# EAGLE design cc1101-sniffer (EAGLE 9.6.2)
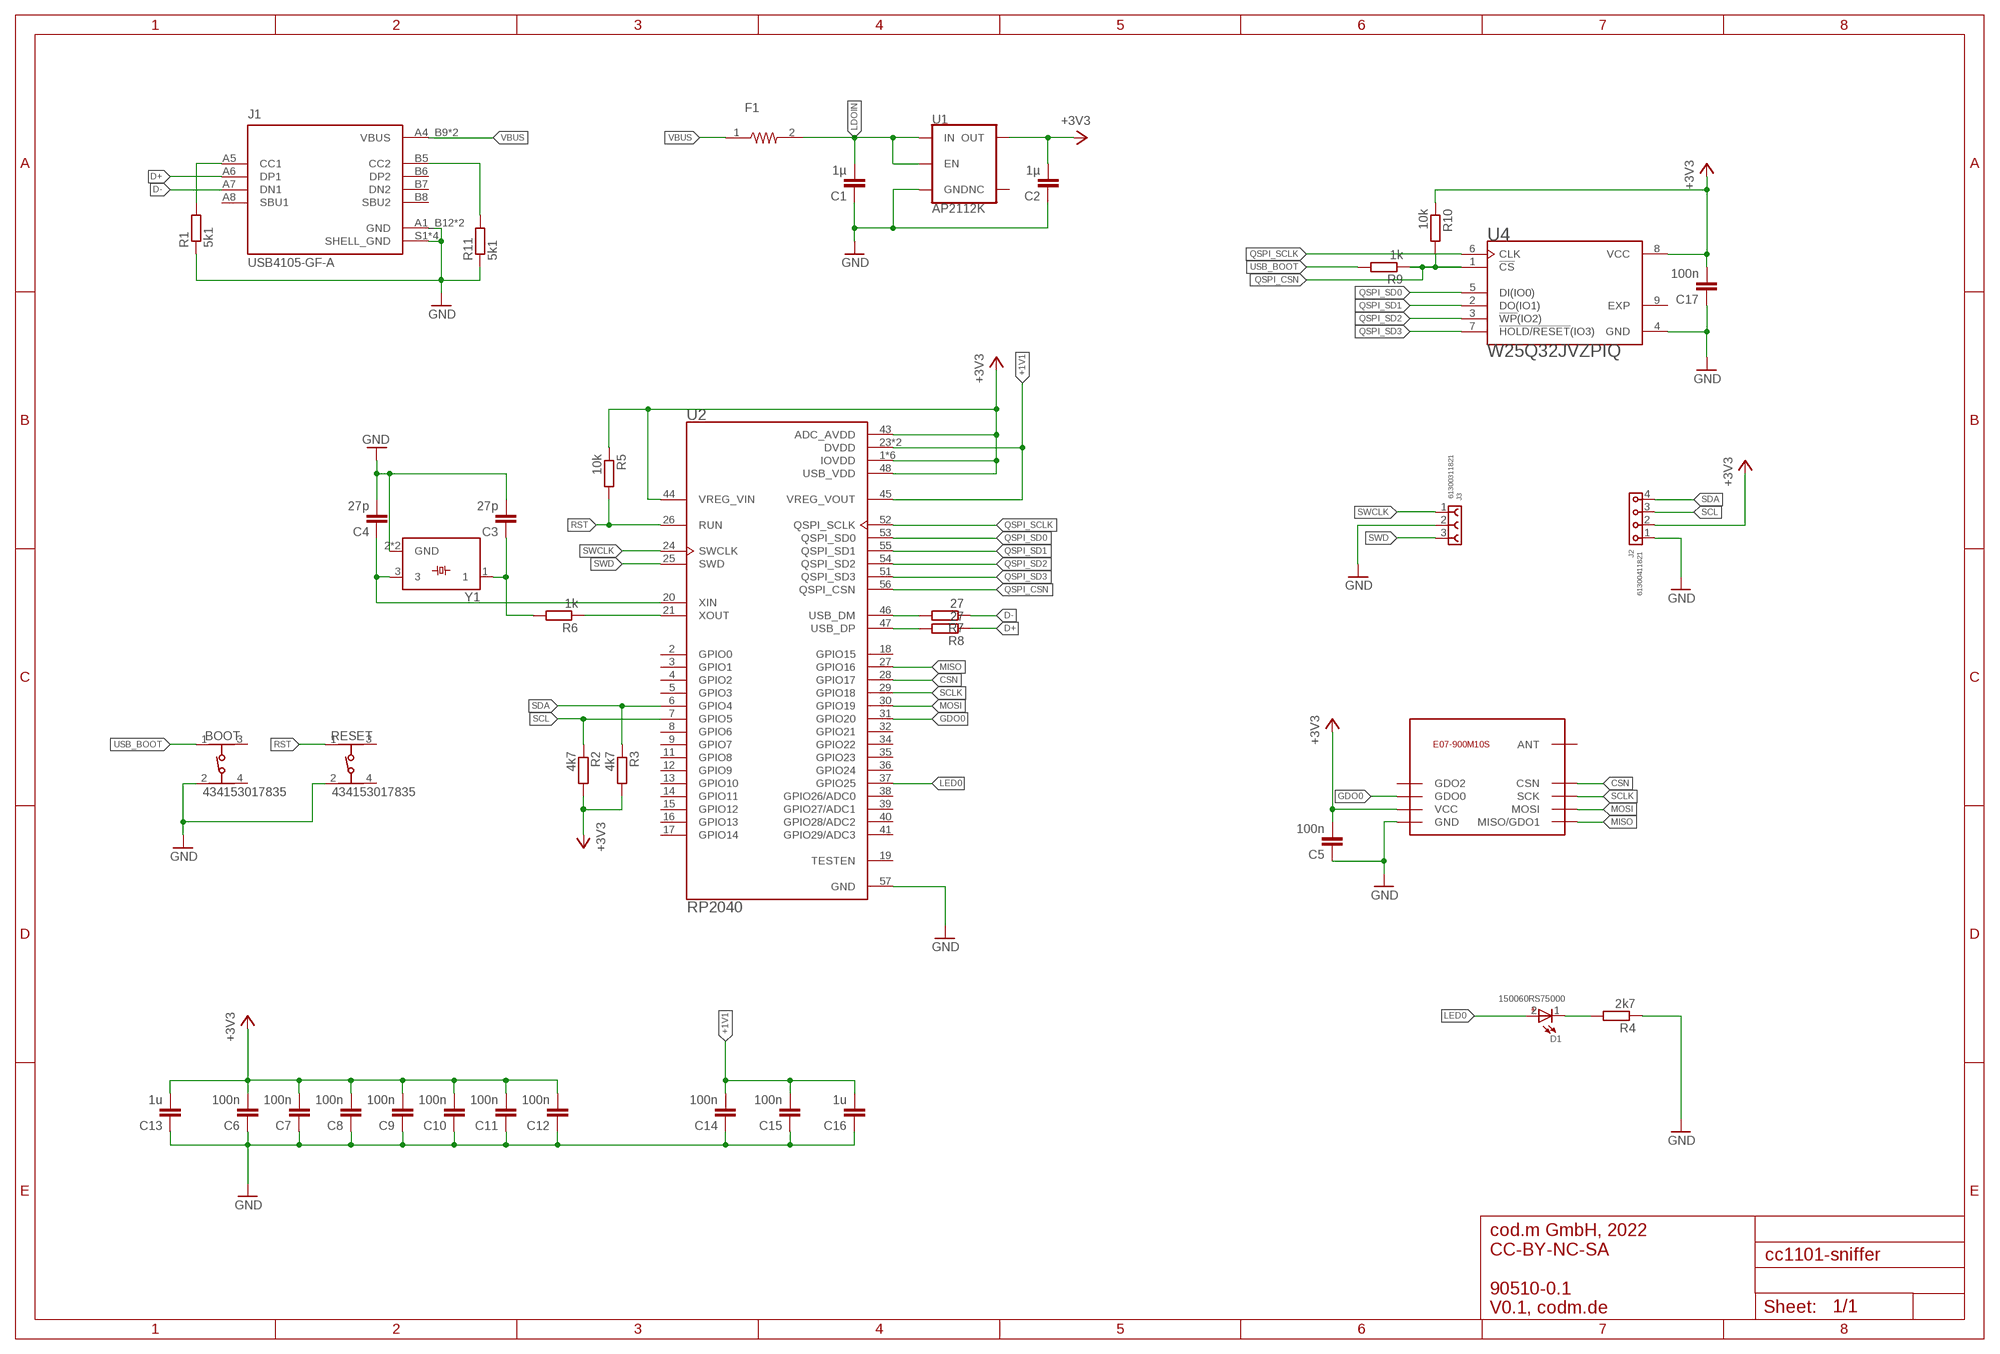
[diagram p0: schematic, sheet 1]

## Parts
BOOT  434153017835  [434153017835]
C1  1µ  C-EUC0805K  [C0805K]
C2  1µ  C-EUC0805K  [C0805K]
C3  27p  C-EUC0603K  [C0603K]
C4  27p  C-EUC0603K  [C0603K]
C5  100n  C-EUC0603K  [C0603K]
C6  100n  C-EUC0603K  [C0603K]
C7  100n  C-EUC0603K  [C0603K]
C8  100n  C-EUC0603K  [C0603K]
C9  100n  C-EUC0603K  [C0603K]
C10  100n  C-EUC0603K  [C0603K]
C11  100n  C-EUC0603K  [C0603K]
C12  100n  C-EUC0603K  [C0603K]
C13  1u  C-EUC0603K  [C0603K]
C14  100n  C-EUC0603K  [C0603K]
C15  100n  C-EUC0603K  [C0603K]
C16  1u  C-EUC0603K  [C0603K]
C17  100n  C-EUC0603K  [C0603K]
D1  150060RS75000  WL-SMCW_0603_150060RS75000  [WL-SMCW_0603]
F1  PICOSMDC050S-2  [RESC2012X65N]
J1  USB4105-GF-A  [GCT_USB4105-GF-A]
J2  61300411821  6130XX11821_61300411821  [61300411821]
J3  61300311821  6130XX11821_61300311821  [61300311821]
R1  5k1  R-EU_R0603RF  [R0603RF]
R2  4k7  R-EU_R0603RF  [R0603RF]
R3  4k7  R-EU_R0603RF  [R0603RF]
R4  2k7  R-EU_R0603RF  [R0603RF]
R5  10k  R-EU_R0603RF  [R0603RF]
R6  1k  R-EU_R0603RF  [R0603RF]
R7  27  R-EU_R0603RF  [R0603RF]
R8  27  R-EU_R0603RF  [R0603RF]
R9  1k  R-EU_R0603RF  [R0603RF]
R10  10k  R-EU_R0603RF  [R0603RF]
R11  5k1  R-EU_R0603RF  [R0603RF]
RESET  434153017835  [434153017835]
U1  AP2112K  V_REG_AP2112K-3.3V  [SOT23-5]
U2  RP2040  [QFN40P700X700X90-57N]
U4  W25Q32JVZPIQ  [SON127P600X500X80-9N]
U$6  E07-900M10S  [E07-900M10S]
Y1  ABM8G-12.000MHZ-18-D2Y-T3  [OSCSC320X250X100N]

## Nets
+1V1: C14.2 C15.2 C16.2 U2.23(DVDD) U2.45(VREG_VOUT) U2.50(DVDD)
+3V3: C2.2 C5.2 C6.2 C7.2 C8.2 C9.2 C10.2 C11.2 C12.2 C13.2 C17.2 J2.2 R2.2 R3.2 R5.1 R10.1 U1.5(OUT) U2.1(IOVDD) U2.10(IOVDD) U2.22(IOVDD) U2.33(IOVDD) U2.42(IOVDD) U2.43(ADC_AVDD) U2.44(VREG_VIN) U2.48(USB_VDD) U2.49(IOVDD) U4.8(VCC) U$6.9(VCC)
CSN: U2.28(GPIO17) U$6.19(CSN)
D+: J1.A6(DP1) R8.1
D-: J1.A7(DN1) R7.1
GDO0: U2.31(GPIO20) U$6.15(GDO0)
GND: BOOT.2 C1.1 C2.1 C3.2 C4.2 C5.1 C6.1 C7.1 C8.1 C9.1 C10.1 C11.1 C12.1 C13.1 C14.1 C15.1 C16.1 C17.1 J1.A1_B12(GND) J1.B1_A12(GND) J1.S1(SHELL_GND) J1.S2(SHELL_GND) J1.S3(SHELL_GND) J1.S4(SHELL_GND) J2.1 J3.2 R1.1 R4.1 R11.1 RESET.2 U1.2(GND) U2.57(GND) U4.4(GND) U$6.1(GND) U$6.2(GND) U$6.3(GND) U$6.4(GND) U$6.5(GND) U$6.11(GND) U$6.12(GND) U$6.20(GND) U$6.22(GND) Y1.2(GND) Y1.4(GND)
LDOIN: C1.2 F1.2 U1.1(IN) U1.3(EN)
LED0: D1.2(+) U2.37(GPIO25)
MISO: U2.27(GPIO16) U$6.16(MISO/GDO1)
MOSI: U2.30(GPIO19) U$6.17(MOSI)
N$1: C4.1 U2.20(XIN) Y1.3
N$2: R6.1 U2.21(XOUT)
N$3: C3.1 R6.2 Y1.1
N$4: R8.2 U2.47(USB_DP)
N$6: J1.A5(CC1) R1.2
N$7: D1.1(-) R4.2
N$8: R7.2 U2.46(USB_DM)
N$9: J1.B5(CC2) R11.2
QSPI_CSN: R9.1 R10.2 U2.56(QSPI_CSN) U4.1(!CS)
QSPI_SCLK: U2.52(QSPI_SCLK) U4.6(CLK)
QSPI_SD0: U2.53(QSPI_SD0) U4.5(DI(IO0))
QSPI_SD1: U2.55(QSPI_SD1) U4.2(DO(IO1))
QSPI_SD2: U2.54(QSPI_SD2) U4.3(!WP!(IO2))
QSPI_SD3: U2.51(QSPI_SD3) U4.7(!HOLD/RESET!(IO3))
RST: R5.2 RESET.1 U2.26(RUN)
SCL: J2.3 R2.1 U2.7(GPIO5)
SCLK: U2.29(GPIO18) U$6.18(SCK)
SDA: J2.4 R3.1 U2.6(GPIO4)
SWCLK: J3.1 U2.24(SWCLK)
SWD: J3.3 U2.25(SWD)
USB_BOOT: BOOT.1 R9.2
VBUS: F1.1 J1.A4_B9(VBUS) J1.B4_A9(VBUS)
Unconnected: BOOT.3 BOOT.4 J1.A8(SBU1) J1.B6(DP2) J1.B7(DN2) J1.B8(SBU2) RESET.3 RESET.4 U1.4(NC) U2.2(GPIO0) U2.3(GPIO1) U2.4(GPIO2) U2.5(GPIO3) U2.8(GPIO6) U2.9(GPIO7) U2.11(GPIO8) U2.12(GPIO9) U2.13(GPIO10) U2.14(GPIO11) U2.15(GPIO12) U2.16(GPIO13) U2.17(GPIO14) U2.18(GPIO15) U2.19(TESTEN) U2.32(GPIO21) U2.34(GPIO22) U2.35(GPIO23) U2.36(GPIO24) U2.38(GPIO26/ADC0) U2.39(GPIO27/ADC1) U2.40(GPIO28/ADC2) U2.41(GPIO29/ADC3) U4.9(EXP) U$6.14(GDO2) U$6.21(ANT)

## Notes on the sheet
- cod.m GmbH, 2022
  CC-BY-NC-SA
  
  90510-0.1
  V0.1, codm.de

## Library data of the parts
BOOT RESET = Eagle_WS-TASV (rev22a):434153017835: WS-TASV J-Bend SMT Tact Switch 3.5x2.9 mm Material Properties Cover Material : Stainless Steel Properties Actuator Material:LCP Actuator Flammability Rating:UL94 V-0 Actuator Color:Blue Frame Material:PA46 Frame Flammability Rating:UL94 HB Frame Color:Black Contact Material:Stainless Steel Contact Plating:Silver Terminal Material:Copper Alloy Terminal Plating:Silver VR:12 V (DC) Contact Resistance Initial:100 mΩ Contact Resistance After Life Test:1 Ω RISO:100 MΩ Withstanding Voltage:250 V (AC) Washable:No Qty.:4000 Mechanical Properties Stroke :0.15 mm General Information Operating Temperature:-40 up to +85 °C Washable:No Packaging Properties Packaging:Tape and Reel <https://www.we-online.com/catalog/media/o72753v209%20WS-TASU_434331013822_a_4C.jpg> Details see: https://www.we-online.com/catalog/en/TASV_3_5X2_9_SMD_J-BEND/ Updated by yingchun,Shan;2020-02-18 2020(C) Würth Elektronik; DATASHEET-URL: https://www.we-online.com/catalog/datasheet/434153017835.pdf; H: 1.7mm; OPERATION-FORCE: 350g; PART-NUMBER: 434153017835; QTY: 4000
C1-C17 = rcl:C-EU: CAPACITOR, European symbol; SPICEPREFIX: C
D1 = Eagle_WL-SMCW (rev22a):WL-SMCW_0603: WL-SMCW SMT Mono-color Chip LED Waterclea Characteristics Low energy consumption High reliability Low current requirement Fast switching No UV/IR radiation Smallest SMD LED package for exceptional brightness Top view LED Wide viewing angle Better solder ability Heat dissipation Applications Backlight for mobile and portable device keypads Indoor and outdoor message boards Flat backlight for LCDs, switches and symbols Display for industrial control systems and traffic Miniaturized color effects Pedestrian mark Optical indicators Tabular backlight: LCD, telephone key-press, power-switch, display board Indoor displays Signals Identifiers Backlight for automobile DVD LED General lighting Toys <https://www.we-online.com/catalog/media/o14904v209%20Family_WL-SMCW.jpg> Details see: https://www.we-online.com/catalog/en/WL-SMCW/ Updated BY Yingchun,Shan 2020-03-18 2020(C) Wurth Elektronik; CHIP-TECHNOLOGY: AlInGaP; DATASHEET-URL: https://www.we-online.com/catalog/datasheet/150060RS75000.pdf; DOMINANT-WAVELENGTH: 625nm; EMITTING-COLOR: Red; FORWARD-VOLTAGE: 140°; LUMINOUS-INTENSITY: 250mcd; PART-NUMBER: 150060RS75000; PEAK-WAVELENGTH: 630nm
F1 = PICOSMDC050S-2:PICOSMDC050S-2: FUSE, RESETTABLE PTC, 6VDC, 0.5A, SMD Check availability <https://pricing.snapeda.com/parts/PICOSMDC050S-2/Littelfuse%20Inc./view-part?ref=eda>; AVAILABILITY: In Stock; DESCRIPTION: Polymeric PTC Resettable Fuse 6V 500 mA Ih Surface Mount 0805 (2012 Metric), Concave; MF: Littelfuse Inc.; MP: PICOSMDC050S-2; PACKAGE: 0805 TE Connectivity; PRICE: None; PURCHASE-URL: https://pricing.snapeda.com/search/part/PICOSMDC050S-2/?ref=eda
J1 = USB4105-GF-A:USB4105-GF-A: USB-C (USB TYPE-C) USB 2.0 Receptacle Connector 24 (16+8 Dummy) Position Surface Mount, Right Angle; Through Hole Check availability <https://pricing.snapeda.com/parts/USB4105-GF-A/GCT/view-part?ref=eda>; AVAILABILITY: In Stock; DESCRIPTION: USB-C (USB TYPE-C) USB 2.0 Receptacle Connector 24 (16+8 Dummy) Position Surface Mount, Right Angle; Through Hole; MF: GCT; MP: USB4105-GF-A; PACKAGE: None; PRICE: None; PURCHASE-URL: https://pricing.snapeda.com/search/part/USB4105-GF-A/?ref=eda
J2 = Eagle_WR-PHD (rev21a):6130XX11821_61300411821: WR-PHD 2.54 mm Socket Header ARTICLE PROPERTIES: Pins:1;​ 2;​ 3;​ 4;​ 5;​ 6;​ 7;​ 8;​ 9;​ 10;​ 12;​ 13;​ 14;​ 15;​ 16;​ 18;​ 20;​ 22;​ 24;​ 25;​ 32;​ 36;​ 40 KIND PROPERTIES: Pitch：2.54 mm Quality Class:3 as per CECC 75 301-802 Rows：Single Gender：Socket Header;​ Female Type：Straight MATERIAL PROPERTIES: Insulator Material :PBT Insulator Flammability Rating:UL94 V-0 Contact Material:Copper Alloy Contact Plating:Gold Contact Type:Stamped GENERAL INFORMATION Operating Temperature:-40 up to +125 °C Compliance:Lead free / RoHS ELECTRICAL PROPERTIES: Rated Current:3 A IR 1:3 A Withstanding Voltage:500 V (AC) Contact Resistance:20 mΩ RISO:1000 MΩ CERTIFICATION UL Approval:E323964 PACKAGING PROPERTIES Packaging:Tray <https://katalog.we-online.com/media/images/v2/o33218v209%20Family_WR-PHD_613xxx11821.jpg> Details see: https://katalog.we-online.com/en/em/PHD_2_54_SOCKET_HEADER_6130XX11821 Updated by Yingchun,Shan 2019-10-21 2019 (C) Würth Elektronik; DATASHEET-URL: https://www.we-online.com/catalog/datasheet/61300411821.pdf; GENDER: Socket Header; IR: 3A; MOUNT: THT; PACKAGING: Tray; PART-NUMBER: 61300411821; PINS: 4; PITCH: 2.54mm; ROWS: Single; TYPE: Straight
J3 = Eagle_WR-PHD (rev21a):6130XX11821_61300311821: WR-PHD 2.54 mm Socket Header ARTICLE PROPERTIES: Pins:1;​ 2;​ 3;​ 4;​ 5;​ 6;​ 7;​ 8;​ 9;​ 10;​ 12;​ 13;​ 14;​ 15;​ 16;​ 18;​ 20;​ 22;​ 24;​ 25;​ 32;​ 36;​ 40 KIND PROPERTIES: Pitch：2.54 mm Quality Class:3 as per CECC 75 301-802 Rows：Single Gender：Socket Header;​ Female Type：Straight MATERIAL PROPERTIES: Insulator Material :PBT Insulator Flammability Rating:UL94 V-0 Contact Material:Copper Alloy Contact Plating:Gold Contact Type:Stamped GENERAL INFORMATION Operating Temperature:-40 up to +125 °C Compliance:Lead free / RoHS ELECTRICAL PROPERTIES: Rated Current:3 A IR 1:3 A Withstanding Voltage:500 V (AC) Contact Resistance:20 mΩ RISO:1000 MΩ CERTIFICATION UL Approval:E323964 PACKAGING PROPERTIES Packaging:Tray <https://katalog.we-online.com/media/images/v2/o33218v209%20Family_WR-PHD_613xxx11821.jpg> Details see: https://katalog.we-online.com/en/em/PHD_2_54_SOCKET_HEADER_6130XX11821 Updated by Yingchun,Shan 2019-10-21 2019 (C) Würth Elektronik; DATASHEET-URL: https://www.we-online.com/catalog/datasheet/61300311821.pdf; GENDER: Socket Header; IR: 3A; MOUNT: THT; PACKAGING: Tray; PART-NUMBER: 61300311821; PINS: 3; PITCH: 2.54mm; ROWS: Single; TYPE: Straight
R1-R11 = codm:R-EU_
U1 = SparkFun-IC-Power:V_REG_AP2112: AP2112 - 600mA CMOS LDO Regulator w/ Enable The AP2112 is CMOS process low dropout linear regulator with enable function, the regulator delivers a guaranteed 600mA (min.) continuous load current. Features Output Voltage Accuracy: ±1.5% Output Current: 600mA (Min.) Foldback Short Current Protection: 50mA Enable Function to Turn ON/OFF VOUT Low Dropout Voltage (3.3V): 250mV (Typ.) @IOUT=600mA Excellent Load Regulation: 0.2%/A (Typ.) Excellent Line Regulation: 0.02%/V (Typ.) Low Quiescent Current: 55μA (Typ.) Low Standby Current: 0.01μA (Typ.) Low Output Noise: 50μVRMS PSRR: 100Hz -65dB, 1kHz -65dB OTSD Protection Stable with 1.0μF Flexible Cap: Ceramic, Tantalum and Aluminum Electrolytic Operation Temperature Range: -40°C to 85°C ESD: MM 400V, HBM 4000V; PROD_ID: VREG-12457; VALUE: 3.3V
U2 = RP2040:RP2040: Check availability <https://pricing.snapeda.com/parts/RP2040/Raspberry%20Pi/view-part?ref=eda>; AVAILABILITY: In Stock; DESCRIPTION: RP2040 chip for Raspberry Pi Pico - ARM® Cortex®-M0+ MCU 32-Bit; MF: Raspberry Pi; MP: RP2040; PACKAGE: Package; PRICE: None; PURCHASE-URL: https://pricing.snapeda.com/search/part/RP2040/?ref=eda
U4 = W25Q32JVZPIQ:W25Q32JVZPIQ: Serial Flash Memory With Dual, Quad Spi Check availability <https://pricing.snapeda.com/parts/W25Q32JVZPIQ/Winbond/view-part?ref=eda>; AVAILABILITY: In Stock; DESCRIPTION: FLASH - NOR Memory IC 32Mb (4M x 8) SPI - Quad I/O 133 MHz 8-WSON (6x5); MF: Winbond; MP: W25Q32JVZPIQ; PACKAGE: WSON-8 Winbond; PRICE: None; PURCHASE-URL: https://pricing.snapeda.com/search/part/W25Q32JVZPIQ/?ref=eda
U$6 = codm:E07-900M10S
Y1 = ABM8G-12.000MHZ-18-D2Y-T3:ABM8G-12.000MHZ-18-D2Y-T3: Crystal 20MHz Â±20ppm (Tol) Â±30ppm (Stability) 18pF FUND 80Ohm 4-Pin Mini-CSMD T/R Check availability <https://pricing.snapeda.com/parts/ABM8G-12.000MHZ-18-D2Y-T3/Abracon/view-part?ref=eda>; AVAILABILITY: In Stock; DESCRIPTION: 12 MHz ±20ppm Crystal 18pF 120 Ohms 4-SMD, No Lead; MF: Abracon; MP: ABM8G-12.000MHZ-18-D2Y-T3; PACKAGE: SMD-4 Abracon; PRICE: None; PURCHASE-URL: https://pricing.snapeda.com/search/part/ABM8G-12.000MHZ-18-D2Y-T3/?ref=eda

## Board
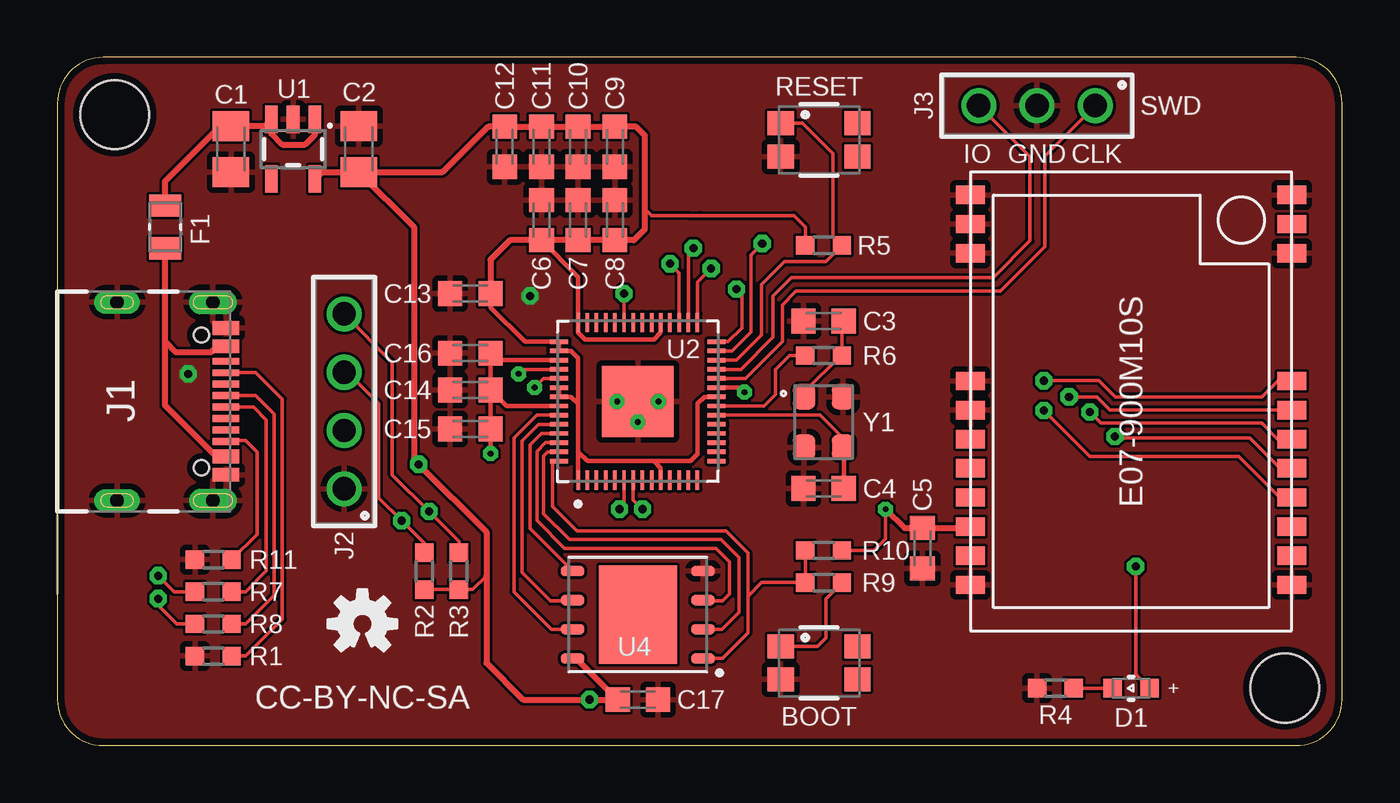
[diagram p1: board, top side]
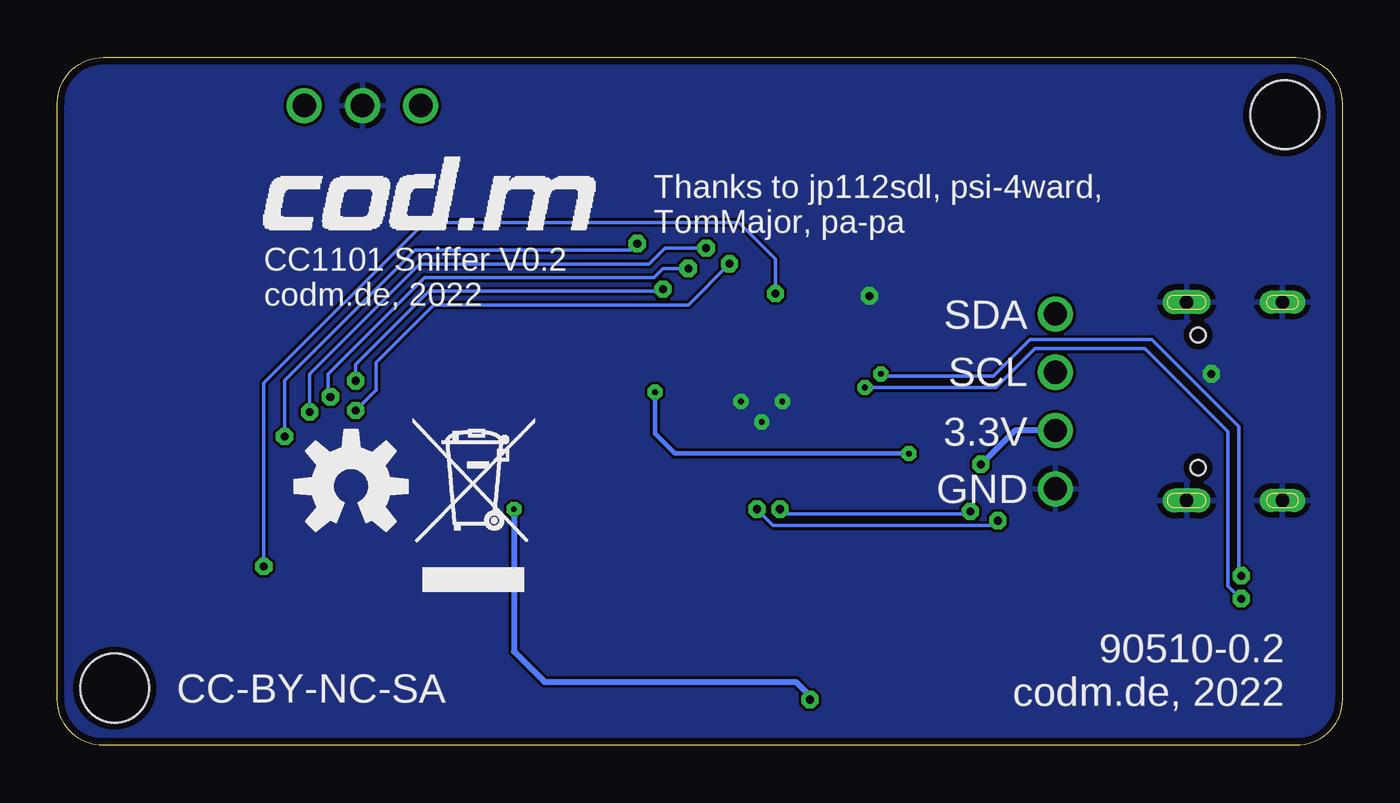
[diagram p2: board, bottom side, seen from below]

Size 56 x 30 mm. Coordinates in mm from the lower left corner, seen from the top.
Outline: 0,2 arc90 2,0 54,0 arc90 56,2 56,28 arc90 54,30 2,30 arc90 0,28 0,2
Copper layers (1*16): Top 0.035mm / dielectric 1.5mm / Bottom 0.035mm
Design rules "aisler_2_layer_complex": minimum track width 0.125mm, minimum drill 0.2mm, track to track 0.125mm, track to pad 0.125mm, pad to pad 0.125mm, via to via 0.125mm, smd to smd 0.125mm, copper to edge 0.3mm, drill to drill 0.25mm, minimum pad ring 0.2mm, minimum via ring 0.2mm, stop-mask expansion 0mil, vias tented up to drill 0mil, thermal gap 10mil
Holes 3 mm at 53.5,2.5 2.5,27.5

### Footprints (pad centres in the part's own frame; a part is rotated, then mirrored left to right if it is on the bottom)
434153017835 = smd 1.15 x 1.05: 1 -1.675,0.725; 2 -1.675,-0.725; 3 1.675,0.725; 4 1.675,-0.725
C0805K = smd 1.3 x 1.6: 1 -1,0; 2 1,0
C0603K = smd 1.05 x 1.08: 1 -0.875,0; 2 0.875,0
WL-SMCW_0603 = smd 0.8 x 0.8: 1 -0.8,0; 2 0.8,0
RESC2012X65N = smd 0.97 x 1.38: 1 -0.93,0; 2 0.93,0
GCT_USB4105-GF-A = smd 0.6 x 1.15: A1_B12 -3.2,4.755; A4_B9 -2.4,4.755; B1_A12 3.2,4.755; B4_A9 2.4,4.755 | smd 0.3 x 1.15: A5 -1.25,4.755; A6 -0.25,4.755; A7 0.25,4.755; A8 1.25,4.755; B5 1.75,4.755; B6 0.75,4.755; B7 -0.75,4.755; B8 -1.75,4.755 | drill 0.6 pad 1.05 long: S1 -4.32,4.18; S4 4.32,4.18 | drill 0.6 pad 1 long: S2 -4.32,0; S3 4.32,0 | hole 0.65: 2.89,3.68; -2.89,3.68
61300411821 = drill 1.02: 1 -3.81,0; 2 -1.27,0; 3 1.27,0; 4 3.81,0
61300311821 = drill 1.02: 1 -2.54,0; 2 0,0; 3 2.54,0
R0603RF = smd 0.8 x 0.8: 1 -0.8,0; 2 0.8,0
SOT23-5 = smd 0.55 x 1.2: 1 -0.95,-1.3; 2 0,-1.3; 3 0.95,-1.3; 4 0.95,1.3; 5 -0.95,1.3
QFN40P700X700X90-57N = smd 0.84 x 0.2: 1 -3.435,2.6; 2 -3.435,2.2; 3 -3.435,1.8; 4 -3.435,1.4; 5 -3.435,1; 6 -3.435,0.6; 7 -3.435,0.2; 8 -3.435,-0.2; 9 -3.435,-0.6; 10 -3.435,-1; 11 -3.435,-1.4; 12 -3.435,-1.8; 13 -3.435,-2.2; 14 -3.435,-2.6; 29 3.435,-2.6; 30 3.435,-2.2; 31 3.435,-1.8; 32 3.435,-1.4; 33 3.435,-1; 34 3.435,-0.6; 35 3.435,-0.2; 36 3.435,0.2; 37 3.435,0.6; 38 3.435,1; 39 3.435,1.4; 40 3.435,1.8; 41 3.435,2.2; 42 3.435,2.6 | smd 0.2 x 0.84: 15 -2.6,-3.435; 16 -2.2,-3.435; 17 -1.8,-3.435; 18 -1.4,-3.435; 19 -1,-3.435; 20 -0.6,-3.435; 21 -0.2,-3.435; 22 0.2,-3.435; 23 0.6,-3.435; 24 1,-3.435; 25 1.4,-3.435; 26 1.8,-3.435; 27 2.2,-3.435; 28 2.6,-3.435; 43 2.6,3.435; 44 2.2,3.435; 45 1.8,3.435; 46 1.4,3.435; 47 1,3.435; 48 0.6,3.435; 49 0.2,3.435; 50 -0.2,3.435; 51 -0.6,3.435; 52 -1,3.435; 53 -1.4,3.435; 54 -1.8,3.435; 55 -2.2,3.435; 56 -2.6,3.435 | smd 3.1 x 3.1: 57 0,0
SON127P600X500X80-9N = smd 1.04 x 0.44: 1 -2.845,1.905; 2 -2.845,0.635; 3 -2.845,-0.635; 4 -2.845,-1.905; 5 2.845,-1.905; 6 2.845,-0.635; 7 2.845,0.635; 8 2.845,1.905 | smd 3.4 x 4.3: 9 0,0
E07-900M10S = smd 0.8 x 1.27: 1 19,14; 2 17.73,14; 3 16.46,14; 4 10.89,14; 5 9.62,14; 6 8.35,14; 7 7.08,14; 8 5.81,14; 9 4.54,14; 10 3.27,14; 11 2,14; 12 2,0; 13 3.27,0; 14 4.54,0; 15 5.81,0; 16 7.08,0; 17 8.35,0; 18 9.62,0; 19 10.89,0; 20 16.46,0; 21 17.73,0; 22 19,0
OSCSC320X250X100N = smd 0.98 x 1.1: 1 -0.85,1.1; 2 -0.85,-1.1; 3 0.85,-1.1; 4 0.85,1.1

### Placement (x,y rotation side)
BOOT  33.2,3.6 0 top
C1  7.57,26 90 top
C2  13.14,26 270 top
C3  33.4,18.5 180 top
C4  33.4,11.2 180 top
C5  37.7,8.6 90 top
C6  21.1,22.9 270 top
C7  22.7,22.9 270 top
C8  24.3,22.9 270 top
C9  24.3,26.1 90 top
C10  22.7,26.1 90 top
C11  21.1,26.1 90 top
C12  19.5,26.1 90 top
C13  18,19.7 0 top
C14  18,15.5 0 top
C15  18,13.8 0 top
C16  18,17.1 0 top
C17  25.3,2 180 top
D1  46.8,2.5 0 top
F1  4.7,22.6 90 top
J1  2.6,15 270 top
J2  12.5,15 90 top
J3  42.7,27.9 180 top
R1  6.8,3.9 0 top
R2  16,7.6 270 top
R3  17.5,7.6 270 top
R4  43.5,2.5 0 top
R5  33.4,21.8 0 top
R6  33.4,17 0 top
R7  6.8,6.7 180 top
R8  6.8,5.3 180 top
R9  33.4,7.1 0 top
R10  33.4,8.5 180 top
R11  6.8,8.1 0 top
RESET  33.2,26.4 0 top
U1  10.28,26 180 top
U2  25.3,15 90 top
U4  25.3,5.7 180 top
U$1  [WEEE-LOGO-5MM]  40.5,6.7 0 bottom
U$3  [OSHW-LOGO-M]  43.2,11.3 0 bottom
U$4  [OSHW-LOGO-S]  13.3,5.3 0 top
U$5  [CODM-LOGO]  47,22.5 0 bottom
U$6  53.8,5 90 top
Y1  33.4,14.1 0 top

### Tracks (layer width: path | path; a pad name or v marks a point on that pad's centre or on a via)
+1V1  (via drill 0.25)
  Top 0.203: U2.45 19.18,16.8 C16.2 C14.2 | v29.95,15.4 29.75,15.6 U2.23 | C14.2 19.57,14.8 U2.50 | C14.2 C15.2 v18.88,12.72
  Bottom 0.203: v29.95,15.4 29.95,13.6 29.07,12.72 v18.88,12.72
+3V3  (via drill 0.25, 0.35)
  Top 0.152: R5.1 32.6,22.6 32.1,23.1 28,23.1 27.5,23.1 25.9,23.1 25.6,23.4 | R2.2 R3.2 18.1,6.8 18.7,7.4 | R10.1 35.6,8.5 36.1,9 v36.1,10.3
  Top 0.203: C13.2 18.88,19.1 20.38,17.6 U2.43 U2.44 22.4,17.2 22.7,16.9 22.7,14.9 | U2.48 U2.49 22.4,15.2 22.7,14.9 | U2.1 22.7,12.8 | 22.7,12.8 22.7,14.9 | 22.7,12.8 23.1,12.4 26,12.4 | 26,12.4 26.3,12.1 U2.10 | 26,12.4 27.6,12.4 27.9,12.7 27.9,14.9 28.2,15.2 U2.22 | C6.2 22.7,20.43 U2.42 22.7,18 23,17.7 26,17.7 26.3,18 U2.33
  Top 0.254: U1.5 11.53,25 C2.2 | C2.2 16.8,25 18.77,26.98 C12.2 C11.2 C10.2 C9.2 25.23,26.98 25.6,26.6 25.6,23.4 25.6,22.5 25.12,22.02 C8.2 C7.2 C6.2 19.73,22.02 18.88,21.18 C13.2 | C2.2 15.54,22.6 15.54,12.46 v15.74,12.26 18.7,9.3 18.7,7.4 18.7,3.6 20.3,2 v23.2,2 24,2 | U4.8 22.6,3.8 24,2.4 24,2 | 24,2 C17.2 | v36.1,10.3 36.92,9.47 C5.2 39.73,9.47 U$6.9
  Bottom 0.254: v36.1,10.3 36.1,4.1 34.77,2.77 23.8,2.77 23.2,2.17 v23.2,2 | J2.2 14.27,13.73 v15.74,12.26
CSN  (via drill 0.35)
  Top 0.152: v29.6,19.9 29.84,19.66 29.84,18.2 29.23,17.6 U2.28 | U$6.19 53.2,15.89 52.5,15.19 46.11,15.19 45.4,15.9 v43,15.9
  Bottom 0.152: v29.6,19.9 29.7,19.8 39.8,19.8 43,16.6 v43,15.9
D+
  Top 0.152: J1.A6 8.65,15.25 9.45,14.45 9.45,6.55 8.2,5.3 R8.1
D-
  Top 0.152: J1.A7 8.55,14.75 9.1,14.2 9.1,7.6 8.2,6.7 R7.1
GDO0  (via drill 0.35)
  Top 0.152: v26.7,21 27.1,20.6 U2.31 | U$6.15 53.29,10.81 51.5,12.6 45,12.6 v43,14.6
  Bottom 0.152: v26.7,21 28.5,19.2 39.6,19.2 42.1,16.7 42.1,15.5 v43,14.6
GND  (via drill 0.25, 0.35)
  other vias: 24.4,15 25.3,14.1 26.2,15 5.7,16.2 20.6,19.6
  pour Top: 0,0 0,30 56,30 56,0
  pour Bottom: 0,0 0,30 56,30 56,0
LDOIN
  Top 0.254: U1.1 11.23,26.63 10.8,26.2 9.8,26.2 9.33,26.67 U1.3 9.03,27 C1.2 7.1,27 4.7,24.6 F1.2
LED0  (via drill 0.35)
  Top 0.152: U2.37 v24.7,19.7 | v47,7.8 47,3.1 D1.2
  Bottom 0.152: v24.7,19.7 24.7,21.2 26.3,22.8 40,22.8 47,15.8 v47,7.8
MISO  (via drill 0.35)
  Top 0.152: U2.27 29.4,17.2 30.22,18.02 30.22,21.39 v30.72,21.89 | U$6.16 53.3,12.08 51.98,13.4 46.17,13.4 v46.1,13.47
  Bottom 0.152: v30.72,21.89 31.02,21.59 40.41,21.59 46.1,15.9 v46.1,13.47
MOSI  (via drill 0.35)
  Top 0.152: U2.30 27.5,21.46 v27.72,21.68 | U$6.17 53.2,13.35 52.5,14.05 45.49,14.05 v45,14.54
  Bottom 0.152: v27.72,21.68 29.52,21.68 30.22,20.98 40.22,20.98 45,16.2 v45,14.54
N$1
  Top 0.152: U2.20 33.25,14.4 34.25,13.4 Y1.3
  Top 0.203: Y1.3 34.27,12.97 C4.1
N$2
  Top 0.152: R6.1 31.9,17 31.3,16.4 31.3,15.3 30.8,14.8 U2.21
N$3
  Top 0.152: Y1.1 32.55,15.4 34.15,17 R6.2 34.2,18.43 C3.1
N$4  (via drill 0.25, 0.35)
  Top 0.152: U2.47 21.2,16 v20.8,15.6 | v4.4,6.4 4.4,6.1 5.2,5.3 R8.2
  Bottom 0.152: v4.4,6.4 4.42,6.4 4.98,6.96 4.98,13.68 8.6,17.3 13.4,17.3 15.1,15.6 v20.8,15.6
N$6
  Top 0.152: R1.2 8.2,3.9 9.8,5.5 9.8,15.1 8.65,16.25 J1.A5
N$7
  Top 0.152: R4.2 D1.1
N$8  (via drill 0.25, 0.35)
  Top 0.152: U2.46 20.3,16.4 v20.1,16.2 | R7.2 5.1,6.7 v4.4,7.4
  Bottom 0.152: v20.1,16.2 20,16.1 15.2,16.1 13.6,17.7 8.3,17.7 4.5,13.9 4.5,7.5 v4.4,7.4
N$9
  Top 0.152: J1.B5 7.41,13.3 8.2,13.3 8.7,12.8 8.7,9.2 R11.2
QSPI_CSN
  Top 0.152: U2.56 21.58,12.4 21.58,10.42 22.64,9.36 29.14,9.36 30.1,8.4 30.1,6.5 | R10.2 R9.1 30.7,7.1 30.1,6.5 | U4.1 29,3.79 30.1,4.9 30.1,6.5
QSPI_SCLK
  Top 0.152: U2.52 20.98,14 20.25,13.27 20.25,7.55 21.5,6.3 22.42,6.3 U4.6
QSPI_SD0
  Top 0.152: U2.53 21.1,13.6 20.6,13.1 20.6,9.46 U4.5
QSPI_SD1
  Top 0.152: U2.55 21.38,12.8 21.2,12.62 21.2,10.1 22.32,8.98 28.92,8.98 29.7,8.2 29.7,5.8 28.96,5.07 U4.2
QSPI_SD2
  Top 0.152: U2.54 21.28,13.2 20.9,12.82 20.9,9.8 22.1,8.6 28.7,8.6 29.3,8 29.3,6.6 29,6.3 28.18,6.3 U4.3
QSPI_SD3
  Top 0.152: U2.51 20.9,14.4 19.9,13.4 19.9,6.7 21.54,5.07 U4.7
RST
  Top 0.152: U2.26 29.6,16.8 30.7,17.9 30.7,20.1 31.7,21.1 33.5,21.1 R5.2 33.8,22.2 33.8,25.8 32.48,27.12 RESET.1
SCL  (via drill 0.35)
  Top 0.152: U2.7 25.1,10.7 v25.5,10.3 | J2.3 12.63,16.27 14,14.9 14,10.8 v15,9.8 16,8.8 R2.1
  Bottom 0.152: v25.5,10.3 24.8,9.6 15.2,9.6 v15,9.8
SCLK  (via drill 0.35)
  Top 0.152: U2.29 27.9,20.2 v28.5,20.8 | U$6.18 45.88,14.62 45.3,15.2 v44.1,15.2
  Bottom 0.152: v28.5,20.8 29.6,20.8 30,20.4 40,20.4 44.2,16.2 44.2,15.3 v44.1,15.2
SDA  (via drill 0.35)
  Top 0.152: U2.6 24.7,10.5 v24.5,10.3 | J2.4 14.6,16.7 14.6,11.8 v16.2,10.2 17.5,8.9 R3.1
  Bottom 0.152: v24.5,10.3 24.3,10.1 16.3,10.1 v16.2,10.2
SWCLK
  Top 0.152: U2.24 30,16 31.6,17.6 31.6,19.2 32.2,19.8 41.1,19.8 43.04,21.74 43.04,25.7 J3.1
SWD
  Top 0.152: U2.25 29.8,16.4 31.2,17.8 31.2,19.6 32,20.4 40.8,20.4 42.4,22 42.4,25.66 J3.3
USB_BOOT
  Top 0.152: BOOT.1 33.12,4.33 33.5,4.7 33.5,6.4 R9.2
VBUS
  Top 0.254: J1.B4_A9 7.31,12.65 6.88,12.65 4.7,14.82 4.7,17.6 | 4.7,17.6 F1.1 | J1.A4_B9 6.95,17.4 6.69,17.14 5.16,17.14 4.7,17.6

### Text on the board
tNames: SWD | IO | GND | CLK | CC-BY-NC-SA
bNames: Thanks to jp112sdl, psi-4ward, / TomMajor, pa-pa | CC1101 Sniffer V0.2 / codm.de, 2022 | SDA | SCL | 3.3V | GND | 90510-0.2 / codm.de, 2022 | CC-BY-NC-SA